# Altium schematic sheet stm32f030.SchDoc
size A4
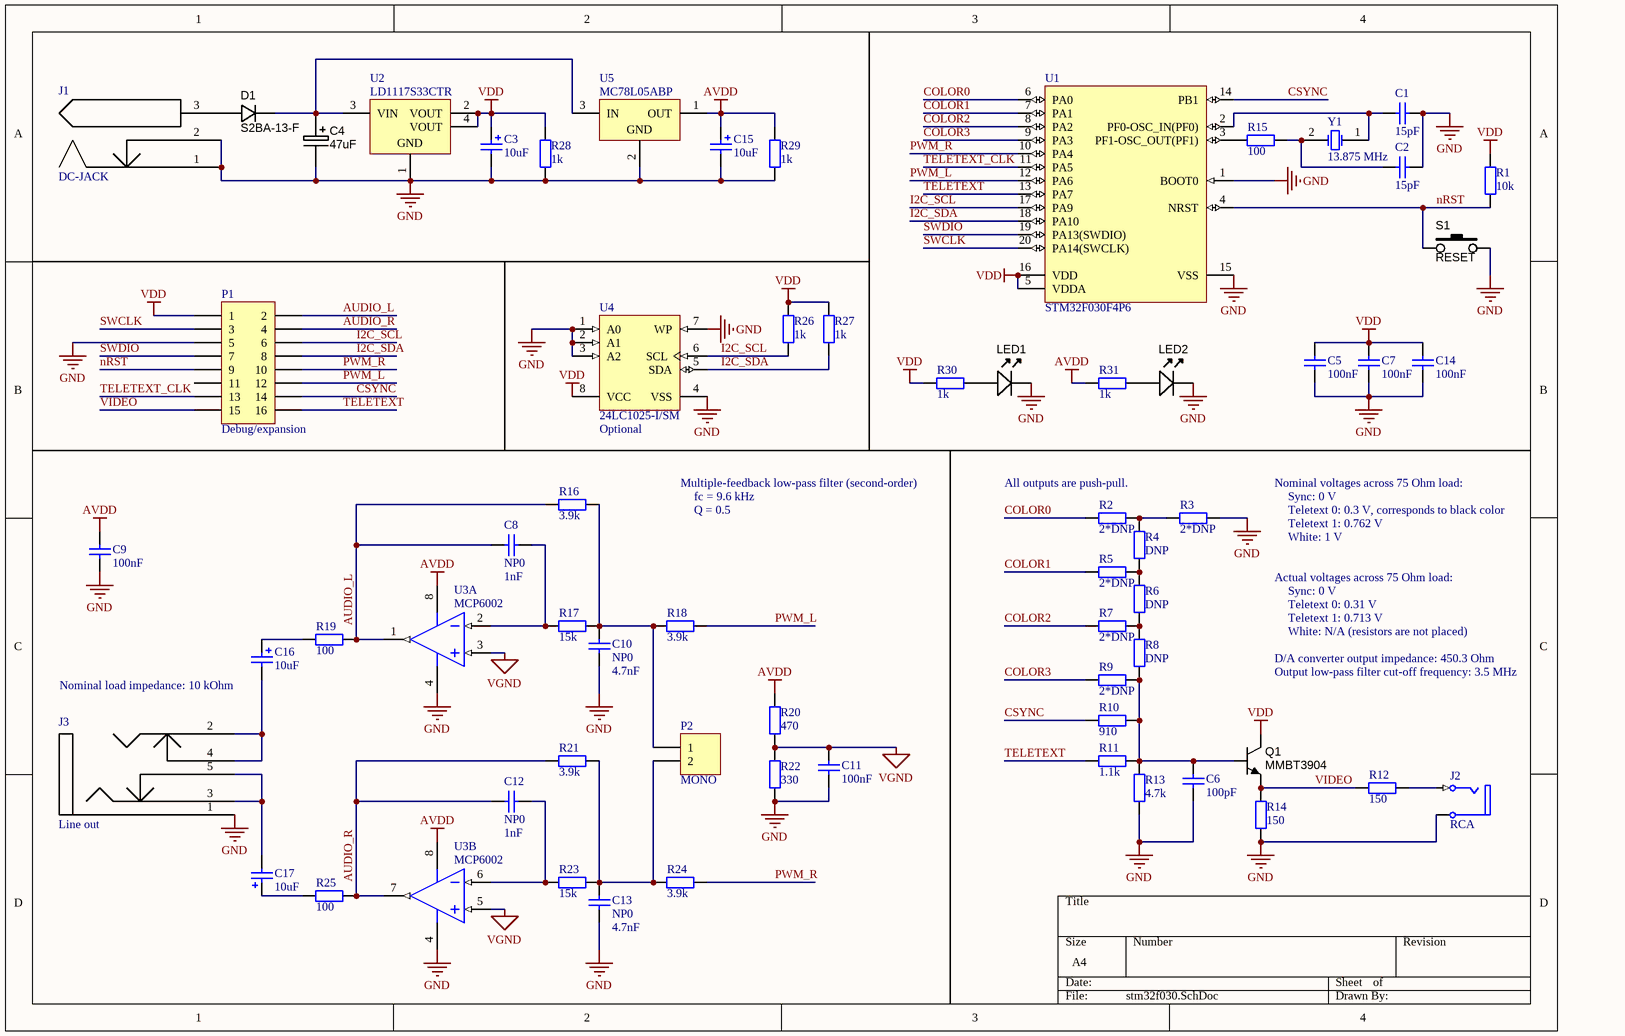
[diagram p0: stm32f030.SchDoc]

## Parts
C1  value 15pF  [CAPC2012X135N]  (hidden comment: Cap)
C2  value 15pF  [CAPC2012X135N]  (hidden comment: Cap)
C3  value 10uF  [CAPMP3528X210N]  (hidden comment: Cap Pol2)
C4  47uF  [CAPE5.0mm]
C5  value 100nF  [CAPC2012X135N]  (hidden comment: Cap)
C6  value 100pF  [CAPC2012X135N]  (hidden comment: Cap)
C7  value 100nF  [CAPC2012X135N]  (hidden comment: Cap)
C8  NP0  value 1nF  [CAPC2012X135N]
C9  value 100nF  [CAPC2012X135N]  (hidden comment: Cap)
C10  NP0  value 4.7nF  [CAPC2012X135N]
C11  value 100nF  [CAPC2012X135N]  (hidden comment: Cap)
C12  NP0  value 1nF  [CAPC2012X135N]
C13  NP0  value 4.7nF  [CAPC2012X135N]
C14  value 100nF  [CAPC2012X135N]  (hidden comment: Cap)
C15  value 10uF  [CAPMP3528X210N]  (hidden comment: Cap Pol2)
C16  value 10uF  [CAPMP3528X210N]  (hidden comment: Cap Pol2)
C17  value 10uF  [CAPMP3528X210N]  (hidden comment: Cap Pol2)
D1  Manufacturer Part Number 1: S2BA-13-F  [DO-214AC]  (hidden comment: 100V; 1.5A)
J1  DC-JACK  [JACK]
J2  RCA  [RCA/4.5-H2]
J3  Line out  [STEREO JACK 3.5 mm]
LED1  (no value)  [LED-0805-K]
LED2  (no value)  [LED-0805-K]
P1  Debug/expansion  [HDR2X8]
P2  MONO  [HDR1X2]
Q1  Manufacturer Part Number 1: MMBT3904  [SOT23-3]  (hidden comment: NPN_MMBT3904)
R1  value 10k  [RESC2012X70N]  (hidden comment: Res2)
R2  value 2*DNP  [RESC2012X70N]  (hidden comment: Res2)
R3  value 2*DNP  [RESC2012X70N]  (hidden comment: Res2)
R4  value DNP  [RESC2012X70N]  (hidden comment: Res2)
R5  value 2*DNP  [RESC2012X70N]  (hidden comment: Res2)
R6  value DNP  [RESC2012X70N]  (hidden comment: Res2)
R7  value 2*DNP  [RESC2012X70N]  (hidden comment: Res2)
R8  value DNP  [RESC2012X70N]  (hidden comment: Res2)
R9  value 2*DNP  [RESC2012X70N]  (hidden comment: Res2)
R10  value 910  [RESC2012X70N]  (hidden comment: Res2)
R11  value 1.1k  [RESC2012X70N]  (hidden comment: Res2)
R12  value 150  [RESC2012X70N]  (hidden comment: Res2)
R13  value 4.7k  [RESC2012X70N]  (hidden comment: Res2)
R14  value 150  [RESC2012X70N]  (hidden comment: Res2)
R15  value 100  [RESC2012X70N]  (hidden comment: Res2)
R16  value 3.9k  [RESC2012X70N]  (hidden comment: Res2)
R17  value 15k  [RESC2012X70N]  (hidden comment: Res2)
R18  value 3.9k  [RESC2012X70N]  (hidden comment: Res2)
R19  value 100  [RESC2012X70N]  (hidden comment: Res2)
R20  value 470  [RESC2012X70N]  (hidden comment: Res2)
R21  value 3.9k  [RESC2012X70N]  (hidden comment: Res2)
R22  value 330  [RESC2012X70N]  (hidden comment: Res2)
R23  value 15k  [RESC2012X70N]  (hidden comment: Res2)
R24  value 3.9k  [RESC2012X70N]  (hidden comment: Res2)
R25  value 100  [RESC2012X70N]  (hidden comment: Res2)
R26  value 1k  [RESC2012X70N]  (hidden comment: Res2)
R27  value 1k  [RESC2012X70N]  (hidden comment: Res2)
R28  value 1k  [RESC2012X70N]  (hidden comment: Res2)
R29  value 1k  [RESC2012X70N]  (hidden comment: Res2)
R30  value 1k  [RESC2012X70N]  (hidden comment: Res2)
R31  value 1k  [RESC2012X70N]  (hidden comment: Res2)
S1  RESET  [TACT-SWITCH-TC-37XB]
U1  STM32F030F4P6  [STM-TSSOP20_N]
U2  LD1117S33CTR  [SOT-223_M]
U3  MCP6002  [N08E]  (parts A,B of 2)
U4  24LC1025-I/SM  [SOIJ-SM8_M]
U5  MC78L05ABP  [29-04]
Y1  13.875 MHz  [HC-49U]

## Nets
AVDD: C9.2 C15.1 R20.1 R29.2 R31.2 U3.8(V+) U5.1(OUT)
GND: C1.1 C2.1 C3.2 C4.2 C5.1 C6.1 C7.1 C9.1 C10.1 C11.1 C13.1 C14.1 C15.2 J1.1 J1.2 J2.1A(Ground) J3.1 LED1.K LED2.K P1.5 R3.2 R13.2 R14.2 R22.2 R28.1 R29.1 S1.2 U1.1(BOOT0) U1.15(VSS) U2.1(GND) U3.4(V-) U4.1(A0) U4.2(A1) U4.3(A2) U4.4(VSS) U4.7(WP) U5.2(GND)
VDD: C3.1 C5.2 C7.2 C14.2 P1.1 Q1.3(C) R1.1 R26.2 R27.2 R28.2 R30.2 U1.5(VDDA) U1.16(VDD) U2.2(VOUT) U2.4(VOUT) U4.8(VCC)
VGND: C11.2 R20.2 R22.1 U3.3(INA+) U3.5(INB+)
AUDIO_L: C8.1 P1.2 R16.2 R19.2 U3.1(OUTA)
AUDIO_R: C12.1 P1.4 R21.2 R25.1 U3.7(OUTB)
COLOR0: R2.1 U1.6(PA0)
COLOR1: R5.1 U1.7(PA1)
COLOR2: R7.1 U1.8(PA2)
COLOR3: R9.1 U1.9(PA3)
CSYNC: P1.14 R10.1 U1.14(PB1)
I2C_SCL: P1.6 R26.1 U1.17(PA9) U4.6(SCL)
I2C_SDA: P1.8 R27.1 U1.18(PA10) U4.5(SDA)
nRST: P1.9 R1.2 S1.1 U1.4(NRST)
PWM_L: P1.12 R18.1 U1.12(PA6)
PWM_R: P1.10 R24.1 U1.10(PA4)
SWCLK: P1.3 U1.20(PA14(SWCLK))
SWDIO: P1.7 U1.19(PA13(SWDIO))
TELETEXT: P1.16 R11.1 U1.13(PA7)
TELETEXT_CLK: P1.13 U1.11(PA5)
VIDEO: P1.15 Q1.2(E) R12.1 R14.1
NetC1_2: C1.2 U1.2(PF0-OSC_IN(PF0)) Y1.1(OSC1)
NetC2_2: C2.2 R15.2 Y1.2(OSC2)
NetC4_1: C4.1 D1.K U2.3(VIN) U5.3(IN)
NetC6_2: C6.2 Q1.1(B) R8.2 R9.2 R10.2 R11.2 R13.1
NetC8_2: C8.2 R17.2 U3.2(INA-)
NetC10_2: C10.2 P2.1 R16.1 R17.1 R18.2
NetC12_2: C12.2 R23.2 U3.6(INB-)
NetC13_2: C13.2 P2.2 R21.1 R23.1 R24.2
NetC16_1: C16.1 R19.1
NetC16_2: C16.2 J3.2 J3.4
NetC17_1: C17.1 R25.2
NetC17_2: C17.2 J3.3 J3.5
NetD1_A: D1.A J1.3
NetJ2_2B: J2.2B(Signal) R12.2
NetLED1_A: LED1.A R30.1
NetLED2_A: LED2.A R31.1
NetR2_2: R2.2 R3.1 R4.1
NetR4_2: R4.2 R5.2 R6.1
NetR6_2: R6.2 R7.2 R8.1
NetR15_1: R15.1 U1.3(PF1-OSC_OUT(PF1))

Not connected (* = marked no-connect by the designer): P1 11

## Notes on the sheet
- (near U4) Optional
- Multiple-feedback low-pass filter (second-order)
- fc = 9.6 kHz
- Q = 0.5
- All outputs are push-pull.
- Nominal voltages across 75 Ohm load:
- Sync: 0 V
- Teletext 0: 0.3 V, corresponds to black color
- Actual voltages across 75 Ohm load:
- Teletext 1: 0.762 V
- White: 1 V
- Teletext 0: 0.31 V
- Teletext 1: 0.713 V
- White: N/A (resistors are not placed)
- (near C16) Nominal load impedance: 10 kOhm
- D/A converter output impedance: 450.3 Ohm
- Output low-pass filter cut-off frequency: 3.5 MHz

## Library data of the parts
C1 C2 C5-C14 = Cap: Capacitor; Published: 8-Jun-2000; LatestRevisionDate: 17-Jul-2002; LatestRevisionNote: Re-released for DXP Platform.; PackageReference: RAD-0.3; Publisher: Altium Limited; PackageDescription: Radial Cap, Thru-Hole; 2 Leads; 0.3 in Pin Spacing
C3 C15-C17 = Cap Pol2_1: Polarized Capacitor (Axial); Published: 8-Jun-2000; LatestRevisionDate: 17-Jul-2002; LatestRevisionNote: Re-released for DXP Platform.; PackageReference: POLAR0.8; Publisher: Altium Limited; PackageDescription: Polarized Capacitor; 2 Leads
C4 = CAPE_33u_200V_THT: Capacitor THT Alum Elec 33uF 20% 200V; Manufacturer 1: Panasonic - ECG; Manufacturer Part Number 1: EEU-ED2D330; Ratings: 200V; 105°C; Material: Al; SCDType: undef; Package / Case: Radial; Tolerance: ±20%; Supplier 1: Digi-Key; Supplier Part Number 1: P13523-ND; Value: 47uF
D1 = DIODE_100V_1.5A_SMA: Diode SMD 100V 1.5A SMA; Manufacturer 1: Diodes Inc; Material: Si; Diode Type: Standard; Value: Vf = 1.15V @ 1.5A (Max); SCDType: source; Package / Case: DO-214AC, SMA; Ratings: 100V; 1.5A; Supplier 1: Digi-Key; Supplier Part Number 1: S2BA-FDICT-ND
J1 = DC-JACK: Tápcsatlakozó
J2 = RCA: RCA Phono Jack, Right Angle, Thru-Hole, Snap-In; PCB_Layout: Complies with manufacturer's recommendation.; DrillAndSlotSize: Corresponds to nominal value.; Published: 15-Jul-2004; LatestRevisionDate: 15-Jul-2004; LatestRevisionNote: Component Replaced.; DatasheetDocument: 7-Jul-2000; PackageDocument: 7-Jul-2000; PackageReference: 161; Publisher: Altium Limited; ComponentLink1Description: Manufacturer Link; ComponentLink1URL: http://www.mouser.com/kobiconn/
J3 = STEREO JACK: Sztereo audio csatlakozó 3,5 mm
LED1 LED2 = LED_SMD_Green_0805_12mcd: LED 0805 SMD Green 12mcd 569nm; Manufacturer 1: LITE-ON; Manufacturer Part Number 1: LTST-C171GKT; Material: GaP; Ratings: 12 mcd; 569 nm; SCDType: source; Package / Case: 0805; Supplier 1: Digi-Key; Supplier Part Number 1: 160-1423-1-ND
P1 = Header 8X2: Header, 8-Pin, Dual row; LatestRevisionDate: 17-Jul-2002; LatestRevisionNote: Re-released for DXP Platform.; Publisher: Altium Limited
P2 = Header 2: Header, 2-Pin; LatestRevisionDate: 17-Jul-2002; LatestRevisionNote: Re-released for DXP Platform.; Publisher: Altium Limited
Q1 = NPN_MMBT3904: Transistor SMD NPN 40V 0.2A 250mW SOT-23; Manufacturer 1: Fairchild Semiconductor; Ratings: 40V; 200mA; 250mW; Material: Si; SCDType: source; Package / Case: SOT-23; Supplier 1: Digi-Key; Supplier Part Number 1: MMBT3904FSCT-ND; Transistor Type: NPN; Mounting Type: Surface Mount; Supplier 2: Digi-Key; Supplier Part Number 2: 568-1741-1-ND; Manufacturer 2: NXP Semiconductors; Manufacturer Part Number 2: PMBT3904,215; ComponentLink2URL: http://www.nxp.com/documents/data_sheet/PMBT3904.pdf; ComponentLink2Description: http://www.nxp.com/documents/data_sheet/PMBT3904.pdf; ComponentLink1URL: http://www.fairchildsemi.com/ds/MM/MMBT3904.pdf; ComponentLink1Description: http://www.fairchildsemi.com/ds/MM/MMBT3904.pdf
R1-R31 = Res2: Resistor; Published: 8-Jun-2000; LatestRevisionDate: 17-Jul-2002; LatestRevisionNote: Re-released for DXP Platform.; PackageReference: AXIAL-0.4; Publisher: Altium Limited; PackageDescription: Axial Device, Thru-Hole; 2 Leads; 0.4 in Pin Spacing
S1 = SW_THT_PB_5.0mm: Switch, tact, 5.0mm stem; Manufacturer 1: Wealth Metal; Manufacturer Part Number 1: TC-37XB; Function: On/Off; SCDType: spec; Package / Case: 6.5x6.5mm; 5.0mm stem; Material: Brass/Nylon/Ag plating
U1 = STM32F030F4P6: ARM Cortex-M0 32-bit MCU, 16 KB Flash, 4 KB Internal RAM, 15 I/Os, 20-pin TSSOP, -40 to 85 degC, Tube; FLASH Size (Prog) (kB): 16; I/Os (High Current): 15; Internal RAM Size (kB): 4; Operating Frequency(F) (Processor speed) (MHz): 48; Supply Voltage(Vcc) min (V): 2.4; DatasheetVersion: Rev. 1; PackageVersion: Rev. 1, 11/2012; PackageReference: TSSOP20; PackageDescription: 20-Pin Thin Shrink Small Outline Package, 6.5 x 4.4 mm Body, 0.65 mm Pitch; Supplier 1: Digi-Key; Supplier Part Number 1: 497-14044-5-ND; Supplier 2: Newark; Supplier Part Number 2: 06X3648; Supplier 3: Mouser; Supplier Part Number 3: 511-STM32F030F4P6; Core: ARM Cortex-M0; Packing: Tube; Mounting Technology: Surface Mount; PartNumber: STM32F030F4P6; ComponentLink1Description: Manufacturer URL; ComponentLink1URL: http://www.st.com/web/en/home.html; ComponentLink2Description: Datasheet; ComponentLink2URL: http://www.st.com/st-web-ui/static/active/en/resource/technical/document/datasheet/DM00088500.pdf; ComponentLink3Description: Package Specification; ComponentLink3URL: http://www.st.com/st-web-ui/static/active/en/resource/technical/document/datasheet/DM00065136.pdf
U2 = LD1117S33CTR: Fixed Low Drop Positive Voltage Regulator, 3.3V, 4-Pin SOT-223, Tape and Reel; DatasheetVersion: Nov-2011; PackageVersion: 2010; PackageReference: SOT-223; PackageDescription: 4-Pin SOT-223 Package, 6.5 x 3.5 mm Body, 2.3 mm Pitch, 7 mm Lead Span; PartNumber: LD1117S33CTR; ComponentLink1Description: Manufacturer URL; ComponentLink1URL: http://www.st.com; ComponentLink2Description: Datasheet; ComponentLink2URL: http://www.st.com/internet/com/TECHNICAL_RESOURCES/TECHNICAL_LITERATURE/DATASHEET/CD00000544.pdf
U3 = TL082CP: Wide Bandwidth Dual JFET Input Operational Amplifier, 8-pin MDIP; Manufacturer: National Semiconductor; PackageTopMarking: NSUZXYTTE#*TL082*CP; PowerWise: N; CompType: Amplifiers; High-Reliability: Y; DatasheetVersion: Aug-2000; PackageVersion: revG, May-2006; PackageReference: N08E; PackageDescription: MDIP, .365 x .250 x .130in, 8 Lead, .100in Pitch; PartNumber: TL082CP; RoHS: N; PinCount: 8; Code_JEDEC: MS-001-BA; ComponentLink1Description: Manufacturer URL; ComponentLink1URL: http://www.national.com/; ComponentLink2Description: TL082 Datasheet; ComponentLink2URL: http://www.national.com/ds/TL/TL082.pdf; ComponentLink3Description: TL082 Web Page; ComponentLink3URL: http://www.national.com/pf/TL/TL082.html; ComponentLink4Description: N08E Package Page; ComponentLink4URL: http://www.national.com/packaging/folders/n08e.html
U4 = 24LC1025-I/SM: 1 Mbit, 400kHz, 2.5V, I2C Serial EEPROM, 8-Pin SOIC 208mil, Industrial Temperature; Published: 29-Jan-2009; DatasheetVersion: revF, Oct-2008; PackageVersion: revBB, Aug-2009; PackageReference: SOIJ-SM8; Publisher: Altium Limited; PackageDescription: 8-Lead Plastic Small Outline (SM) - Medium, 5.28 mm Body [SOIJ]; Supplier 1: Digi-Key; Supplier Part Number 1: 24LC1025-I/SM-ND; Supplier 2: Farnell; Supplier Part Number 2: 1331323; ComponentLink1Description: Datasheet; ComponentLink1URL: http://ww1.microchip.com/downloads/en/DeviceDoc/21941F.pdf; ComponentLink2Description: Packaging Specification; ComponentLink2URL: http://www.microchip.com/stellent/groups/techpub_sg/documents/packagingspec/en012702.pdf; ComponentLink3Description: Microchip.com Home; ComponentLink3URL: http://www.microchip.com/
U5 = MC78L05ABP: Three-Terminal Low Current Positive Voltage Regulator; Published: 15-Apr-2002; DatasheetVersion: Oct-1999; PackageVersion: 1996; PackageReference: 29-04; Publisher: Altium Limited; PackageDescription: TO, Flat Index; 3 In-Line, Axial Leads; Body Dia. 4.8mm; Leads 0.48 x 0.51 mm (max); ComponentLink1Description: Manufacturer Link; ComponentLink1URL: http://www.onsemi.com/site/products/taxonomy/0,4438,503,00.html; ComponentLink2Description: Datasheet; ComponentLink2URL: http://www.onsemi.com/pub/Collateral/MC78L00A-D.PDF
Y1 = ECS-10-13-1: Crystal Oscillator; Published: 17-Jul-2002; DatasheetDocument: 18-Apr-2000; PackageReference: HC-49U; Publisher: Altium Limited; ComponentLink1Description: Manufacturer Link; ComponentLink1URL: http://www.ecsxtal.com/; ComponentLink2Description: Datasheet; ComponentLink2URL: http://www.ecsxtal.com/pdf2/HC49U.PDF